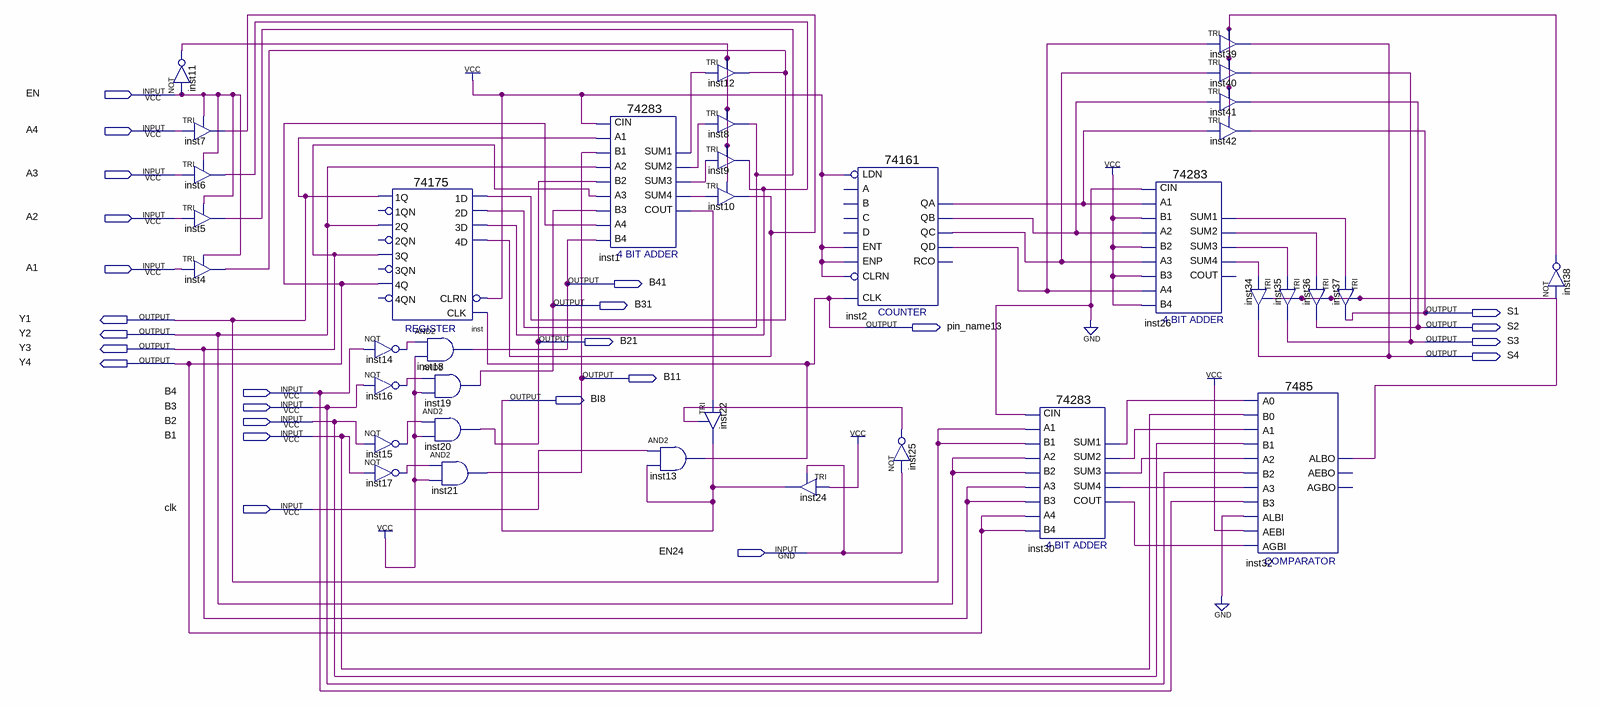
[diagram p0: schematic sheet]
// Quartus schematic divider.bdf as structural Verilog: 36 symbols, 25 pins
module divider (
  input  EN,
  input  A4,
  input  A3,
  input  A2,
  input  A1,
  input  B4,
  input  B3,
  input  B2,
  input  B1,
  input  clk,
  input  EN24,
  output B41,
  output B31,
  output S1,
  output Y1,
  output pin_name13,
  output S2,
  output Y2,
  output B21,
  output S3,
  output Y3,
  output S4,
  output Y4,
  output B11,
  output BI8
);

  wire inst1_cout, inst1_sum1, inst1_sum2, inst1_sum3, inst1_sum4, inst2_qa, inst2_qb, inst2_qc, inst2_qd,
       inst4_out, inst5_out, inst6_out, inst7_out, inst11_out, inst14_out, inst15_out, inst16_out,
       inst17_out, inst25_out, inst26_sum1, inst26_sum2, inst26_sum3, inst26_sum4, inst30_cout, inst30_sum1,
       inst30_sum2, inst30_sum3, inst30_sum4, inst32_albo, inst38_out;

  not inst11 (inst11_out, EN);
  TRI inst7 (.IN(A4), .OE(EN), .OUT(inst7_out));
  TRI inst6 (.IN(A3), .OE(EN), .OUT(inst6_out));
  TRI inst5 (.IN(A2), .OE(EN), .OUT(inst5_out));
  TRI inst4 (.IN(A1), .OE(EN), .OUT(inst4_out));
  not inst14 (inst14_out, B4);
  not inst16 (inst16_out, B3);
  not inst15 (inst15_out, B2);
  not inst17 (inst17_out, B1);
  \74175  inst (
    .CLRN(1'b1), .CLK(pin_name13), .\3D (inst6_out), .\2D (inst5_out), .\1D (inst4_out), .\4D (inst7_out),
    .\1Q (Y1), .\3Q (Y3), .\2Q (Y2), .\4Q (Y4));  // open: 1QN, 2QN, 4QN, 3QN
  and inst18 (B41, inst14_out, 1'b1);
  and inst19 (B31, inst16_out, 1'b1);
  and inst20 (B21, inst15_out, 1'b1);
  and inst21 (B11, inst17_out, 1'b1);
  \74283  inst1 (
    .CIN(1'b1), .A1(Y1), .A2(Y2), .B2(B21), .A3(Y3), .A4(Y4), .B4(B41), .B1(B11), .B3(B31),
    .SUM4(inst1_sum4), .COUT(inst1_cout), .SUM1(inst1_sum1), .SUM2(inst1_sum2), .SUM3(inst1_sum3));
  and inst13 (pin_name13, clk, BI8);
  TRI inst12 (.IN(inst1_sum1), .OE(inst11_out), .OUT(inst4_out));
  TRI inst8 (.IN(inst1_sum2), .OE(inst11_out), .OUT(inst5_out));
  TRI inst9 (.IN(inst1_sum3), .OE(inst11_out), .OUT(inst6_out));
  TRI inst10 (.IN(inst1_sum4), .OE(inst11_out), .OUT(inst7_out));
  TRI inst22 (.IN(inst1_cout), .OE(inst25_out), .OUT(BI8));
  TRI inst24 (.IN(1'b1), .OE(EN24), .OUT(BI8));
  \74161  inst2 (
    .CLRN(1'b1), .CLK(pin_name13), .ENP(1'b1), .LDN(1'b1), .ENT(1'b1), .QD(inst2_qd), .QC(inst2_qc),
    .QB(inst2_qb), .QA(inst2_qa));  // open: A, D, B, C, RCO
  not inst25 (inst25_out, EN24);
  \74283  inst30 (
    .CIN(1'b0), .A1(Y1), .A2(Y2), .B2(Y2), .A3(Y3), .A4(Y4), .B4(Y4), .B1(Y1), .B3(Y3), .SUM4(inst30_sum4),
    .COUT(inst30_cout), .SUM1(inst30_sum1), .SUM2(inst30_sum2), .SUM3(inst30_sum3));
  \74283  inst26 (
    .CIN(1'b0), .A1(inst2_qa), .A2(inst2_qb), .B2(1'b1), .A3(inst2_qc), .A4(inst2_qd), .B4(1'b1), .B1(1'b1),
    .B3(1'b1), .SUM4(inst26_sum4), .SUM1(inst26_sum1), .SUM2(inst26_sum2), .SUM3(inst26_sum3));  // open: COUT
  TRI inst39 (.IN(inst2_qd), .OE(inst38_out), .OUT(S4));
  TRI inst40 (.IN(inst2_qc), .OE(inst38_out), .OUT(S3));
  TRI inst41 (.IN(inst2_qb), .OE(inst38_out), .OUT(S2));
  TRI inst42 (.IN(inst2_qa), .OE(inst38_out), .OUT(S1));
  TRI inst34 (.IN(inst26_sum4), .OE(inst32_albo), .OUT(S4));
  TRI inst35 (.IN(inst26_sum3), .OE(inst32_albo), .OUT(S3));
  \7485  inst32 (
    .A3(inst30_sum4), .B2(B3), .A2(inst30_sum3), .AEBI(1'b1), .AGBI(inst30_cout), .ALBI(1'b0),
    .A0(inst30_sum1), .B0(B1), .B3(B4), .A1(inst30_sum2), .B1(B2), .ALBO(inst32_albo));  // open: AGBO, AEBO
  TRI inst36 (.IN(inst26_sum2), .OE(inst32_albo), .OUT(S2));
  TRI inst37 (.IN(inst26_sum1), .OE(inst32_albo), .OUT(S1));
  not inst38 (inst38_out, inst32_albo);
endmodule
